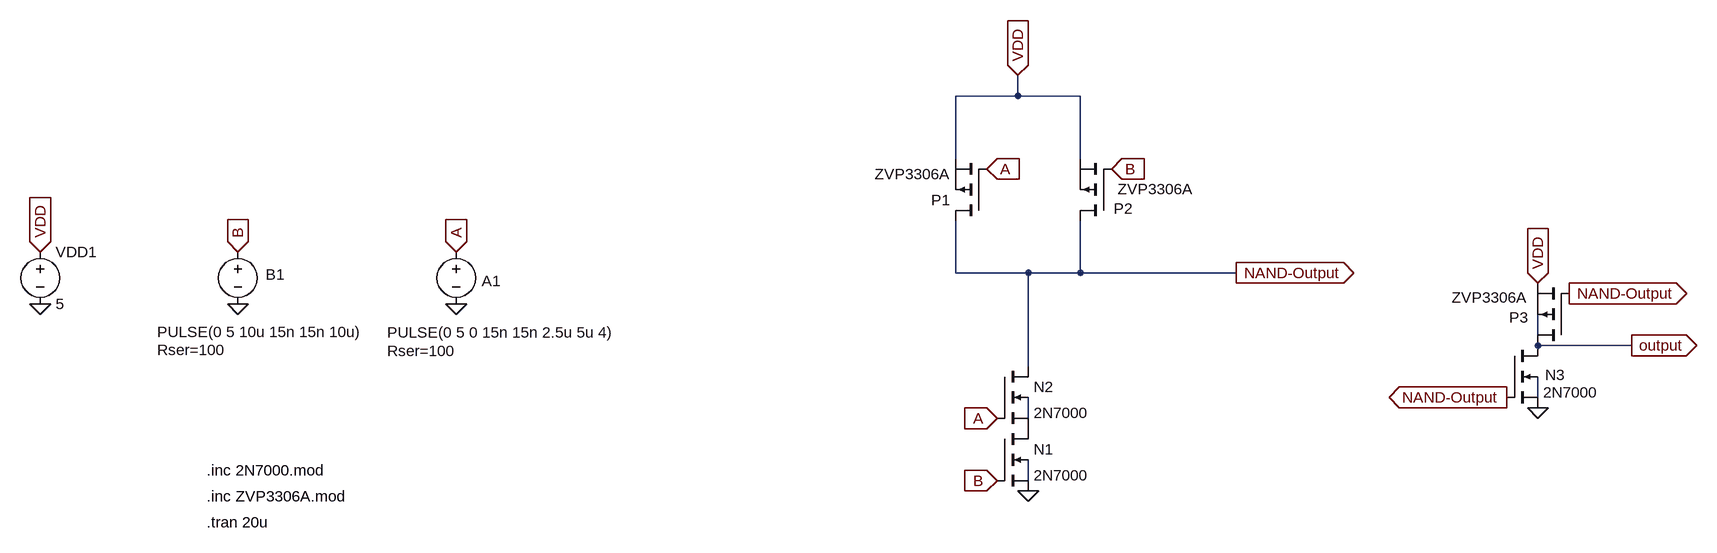
[diagram p0: schematic AND.asc]
AND.asc, the LTspice schematic file:
Version 4.1
SHEET 1 1720 680
WIRE 640 -240 640 -272
WIRE 640 -240 544 -240
WIRE 736 -240 640 -240
WIRE 544 -144 544 -240
WIRE 736 -144 736 -240
WIRE 544 32 544 -48
WIRE 656 32 544 32
WIRE 736 32 736 -48
WIRE 736 32 656 32
WIRE 976 32 736 32
WIRE 1440 128 1440 96
WIRE 1584 144 1440 144
WIRE 656 176 656 32
WIRE 1440 224 1440 192
WIRE 656 256 656 224
WIRE 656 352 656 320
FLAG 656 368 0
FLAG -224 0 A
IOPIN -224 0 In
FLAG -224 80 0
FLAG -560 0 B
IOPIN -560 0 In
FLAG -560 80 0
FLAG -864 0 VDD
IOPIN -864 0 In
FLAG -864 80 0
FLAG 640 -272 VDD
IOPIN 640 -272 In
FLAG 976 32 NAND-Output
IOPIN 976 32 Out
FLAG 592 -128 A
IOPIN 592 -128 In
FLAG 608 256 A
IOPIN 608 256 In
FLAG 784 -128 B
IOPIN 784 -128 In
FLAG 608 352 B
IOPIN 608 352 In
FLAG 1440 240 0
FLAG 1584 144 output
IOPIN 1584 144 Out
FLAG 1488 64 NAND-Output
IOPIN 1488 64 Out
FLAG 1392 224 NAND-Output
IOPIN 1392 224 Out
FLAG 1440 48 VDD
IOPIN 1440 48 In
SYMBOL pmos 592 -48 R180
SYMATTR InstName P1
SYMATTR Value ZVP3306A
SYMATTR Prefix X
SYMBOL nmos4 608 272 R0
SYMATTR InstName N1
SYMATTR Value 2N7000
SYMATTR Prefix X
SYMBOL pmos 784 -48 R180
WINDOW 0 -33 19 Left 2
WINDOW 3 -126 49 Left 2
SYMATTR InstName P2
SYMATTR Value ZVP3306A
SYMATTR Prefix X
SYMBOL nmos4 608 176 R0
SYMATTR InstName N2
SYMATTR Value 2N7000
SYMATTR Prefix X
SYMBOL voltage -224 -16 R0
WINDOW 0 39 61 Left 2
WINDOW 3 -106 140 Left 2
WINDOW 123 0 0 Left 0
WINDOW 39 -106 168 Left 2
SYMATTR InstName A1
SYMATTR Value PULSE(0 5 0 15n 15n 2.5u 5u 4)
SYMATTR SpiceLine Rser=100
SYMBOL voltage -560 -16 R0
WINDOW 0 43 51 Left 2
WINDOW 3 -124 139 Left 2
WINDOW 123 0 0 Left 0
WINDOW 39 -124 167 Left 2
SYMATTR InstName B1
SYMATTR Value PULSE(0 5 10u 15n 15n 10u)
SYMATTR SpiceLine Rser=100
SYMBOL voltage -864 -16 R0
WINDOW 123 0 0 Left 0
WINDOW 39 0 0 Left 0
SYMATTR InstName VDD1
SYMATTR Value 5
SYMBOL nmos4 1392 144 R0
WINDOW 0 59 45 Left 2
SYMATTR InstName N3
SYMATTR Value 2N7000
SYMATTR Prefix X
SYMBOL pmos 1488 144 R180
WINDOW 0 63 43 Left 2
WINDOW 3 64 74 Left 2
SYMATTR InstName P3
SYMATTR Value ZVP3306A
SYMATTR Prefix X
TEXT -608 336 Left 2 !.inc 2N7000.mod
TEXT -608 376 Left 2 !.inc ZVP3306A.mod
TEXT -608 416 Left 2 !.tran 20u

The netlist it stands for:
* AND.asc
X§P1 NAND-Output A VDD ZVP3306A  ; pins D G S
X§N1 P001 B 0 N004 2N7000  ; pins D G S B
X§P2 NAND-Output B VDD ZVP3306A  ; pins D G S
X§N2 NAND-Output A P001 N003 2N7000  ; pins D G S B
V§A1 A 0 PULSE(0 5 0 15n 15n 2.5u 5u 4) Rser=100
V§B1 B 0 PULSE(0 5 10u 15n 15n 10u) Rser=100
VDD1 VDD 0 5
X§N3 output NAND-Output 0 N002 2N7000  ; pins D G S B
X§P3 output NAND-Output VDD ZVP3306A  ; pins D G S
.inc 2N7000.mod
.inc ZVP3306A.mod
.tran 20u
.backanno
.end